# Altium project Function_Generator.PrjPcb
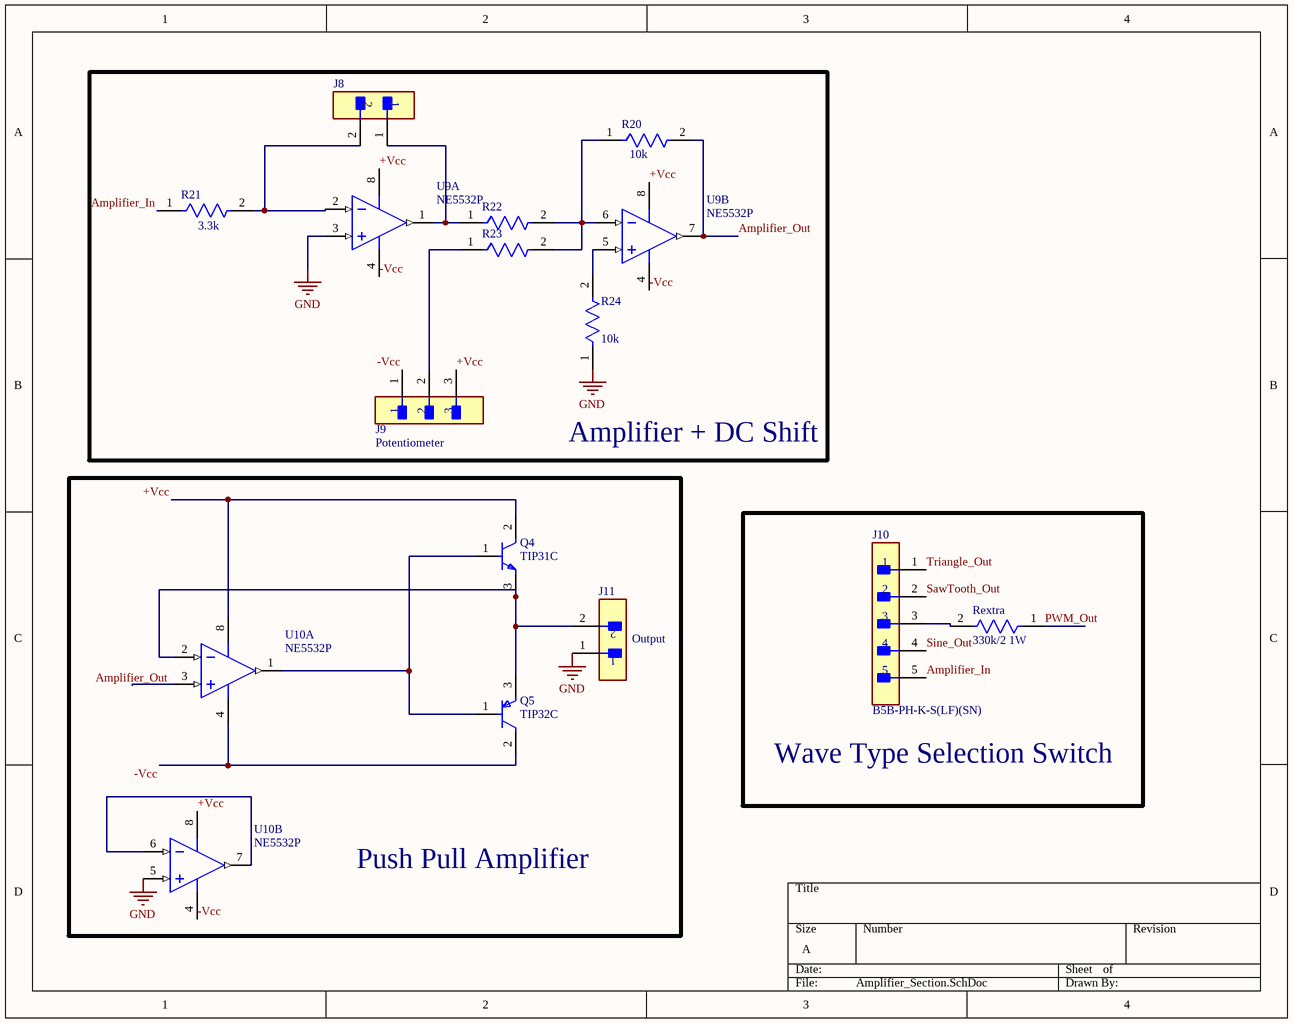
[diagram p0: Amplifier_Section.SchDoc]
6 sheets, 73 parts. Net scope: global (net labels, ports and power ports of the same name join across sheets).
Board file: The_PCB.PcbDoc
Sheets:
  Amplifier_Section.SchDoc
  Saw Tooth and PWM Generator.SchDoc
  Sine_Wave_Generator.SchDoc
  Buffers.SchDoc
  Triangle_Generator.SchDoc
  Power_Supply.SchDoc

## Sheet Amplifier_Section.SchDoc
size A; SheetNumber: 1; SheetTotal: 6

### Parts
J8  (no value)  [FP-B2B-XH-A_LF_SN-MFG]
J9  Potentiometer  [FP-440054-3-MFG]
J10  B5B-PH-K-S(LF)(SN)  [FP-B5B-PH-K-S_LF_SN-MFG]
J11  Output  [FP-B2B-XH-A_LF_SN-MFG]
Q4  TIP31C  [FP-TO-220-P0A0015988-MFG]
Q5  TIP32C  [FP-TO-220-P0A0015988-MFG]
R20  10k  [FP-VR37-MFG]
R21  3.3k  [FP-VR37-MFG]
R22  (no value)  [FP-VR37-MFG]
R23  (no value)  [FP-VR37-MFG]
R24  10k  [FP-VR37-MFG]
Rextra  330k/2 1W  [FP-RR01-MFG]
U9  NE5532P  [P0008A]  (parts A,B of 2)
U10  NE5532P  [P0008A]  (parts A,B of 2)

### Blocks framed on the sheet
Amplifier + DC Shift: J8 J9 R20-R24 U9
Push Pull Amplifier: J11 Q4 Q5 U10
Wave Type Selection Switch: J10 Rextra

### Nets
GND: J11.1 R24.1 U9.3(IN1+) U10.5(IN2+)
+Vcc: J9.3 Q4.2(C) U9.8(VCC+) U10.8(VCC+)
-Vcc: J9.1 Q5.2(C) U9.4(VCC-) U10.4(VCC-)
Amplifier_In: J10.5 R21.1
Amplifier_Out: R20.2 U9.7(OUT2) U10.3(IN1+)
PWM_Out: Rextra.1
SawTooth_Out: J10.2
Sine_Out: J10.4
Triangle_Out: J10.1
NetJ8_1: J8.1 R22.1 U9.1(OUT1)
NetJ8_2: J8.2 R21.2 U9.2(IN1-)
NetJ9_2: J9.2 R23.1
NetJ10_3: J10.3 Rextra.2
NetJ11_2: J11.2 Q4.3(E) Q5.3(E) U10.2(IN1-)
NetQ4_1: Q4.1(B) Q5.1(B) U10.1(OUT1)
NetR20_1: R20.1 R22.2 R23.2 U9.6(IN2-)
NetR24_2: R24.2 U9.5(IN2+)
NetU10_6: U10.6(IN2-) U10.7(OUT2)

### Library data of the parts
J8 J11 = CMP-2000-05888-3: CONN HEADER VERT 2POS 2.5MM; Current Rating: 3A; Voltage Rating: 250V; Number of Contacts: 2; Contact Resistance: 20mR; Wire/Cable Gauge: 22AWG; Insulation Resistance: 1GR; Connector Type: Male Pin; Packaging: Bulk; Contact Material: Brass; Lead Free: Lead Free; Orientation: Straight; Contact Plating: Tin; Max Current Rating: 3A; Termination: Solder; Fastening Type: Detent; Depth: 5.75mm; Housing Material: Polyamide; REACH SVHC: No SVHC; Series: XH; Voltage Rating (AC): 250V; Number of Positions: 2; Color: Natural; Contact Type: Male Pin; Max Voltage Rating (DC): 250V; Pitch: 2.5mm; Lead Pitch: 2.5mm; Mount: Through Hole; Max Operating Temperature: 85°C; Length: 7.4mm; Max Voltage Rating (AC): 250V; Min Operating Temperature: -25°C; Number of Rows: 1; Housing Color: White
J9 = CMP-03369-000008-1: CONN HEADER VERT 3POS 2MM; Manufacturer: TE Connectivity; Manufacturer Part Number: 440054-3; Voltage Rating: 250V; Number Of Contacts: 3; Conn Gender: Male; Conn Orientation: Vertical; Current Rating: 3A; Octopart: https://octopart.com/440054-3-te+connectivity-40394845; Device Class L3: unset; Device Class L1: Connectors; Number Of Rows: 1; Temperature: -25°C to +105°C; Temperature Range Low: -25°C; Automotive: No; Package: 0; ComponentLink2URL: https://www.te.com/usa-en/product-440054-3.datasheet.pdf; Device Class L2: Headers and Wire Housings; Temperature Range High: +105°C; Digikey Description: CONN HEADER VERT 3POS 2MM; Contact Material: Tin,Nickel; Footprint Url: https://www.te.com/commerce/DocumentDelivery/DDEController?Action=showdoc&DocId=Customer+Drawing%7F440054%7FF6%7Fpdf%7FEnglish%7FENG_CD_440054_F6.pdf%7F440054-3; RoHS: TRUE; ComponentLink2Description: Datasheet; Mouser Description: Headers & Wire Housings 3 POS HDR VERT 2.0mm; Lead Free: Yes; Category: Conn; Height: 6.35mm; Pitch: 2mm
J10 = CMP-2000-05908-2: CONN HEADER VERT 5POS 2MM; Voltage Rating (AC): 100V; Number of Positions: 5; Contact Resistance: 20mR; Insulation Resistance: 1MR; Current Rating: 2A; Gender: Male; Mated Stacking Heights: 8mm; Series: PH; Number of Poles: 5; Width: 4.5mm; Insulation Color: Natural; Fastening Type: Detent; Flammability Rating: UL94 V-0; Mount: Through Hole; Lead Free: Lead Free; Number of Rows: 1; REACH SVHC: No SVHC; Max Voltage Rating (AC): 100V; Contact Mating Length: 0.13inch; Contact Plating: Tin; Housing Material: Polyamide; Depth: 4.5mm; Contact Type: Male Pin; Voltage Rating: 100V; Color: Natural; Housing Color: White; Lead Pitch: 2mm; Number of Contacts: 5; Orientation: Straight; Packaging: Bulk; Contact Material: Brass; Pitch: 2mm; Insulation Material: Nylon; Connector Type: Header; Contact Finish - Mating: TIN; Termination: Solder; Number of Pins: 5; Length: 11.9mm; Contact Shape: Square; Max Current Rating: 2A; Working Voltage: 100V; Min Operating Temperature: -25°C; Max Operating Temperature: 85°C; Material: Polyamide; Height: 9.4mm
Q4 = CMP-12195-000001-1: TRANS NPN 100V 3A TO-220; Manufacturer: STMicroelectronics; Hfe Max: 50; Number Of Npn: 1; Max Junction Temp: +150°C; Standoff Height: 3.5mm; Emitter Base Voltage: 5V; Collector Emitter Saturation Voltage: 1.2V; Power Dissipation: 2W; Hfe Testvce: 4V; Hfe Min: 10; Device Class L2: Transistors; ComponentLink2URL: https://www.st.com/resource/en/datasheet/tip31c.pdf; Device Class L1: Discrete Semiconductors; Digikey Description: TRANS NPN 100V 3A TO-220; Max Collector Current: 3A; RoHS: TRUE; Height: 19.68mm; Mouser Description: Bipolar Transistors - BJT NPN Gen Pur Power; Number Of Elements: 1; Package: TO-220-P0A0015988; Temperature: to +150°C; Octopart: https://octopart.com/tip31c-stmicroelectronics-15555; Manufacturer Part Number: TIP31C; Category: Trans; Hfe Testic: 3A; Lead Free: Yes; Collector Base Voltage: 100V; Device Class L3: BJTs; Collector Emitter Voltage: 100V; Automotive: No; ComponentLink2Description: Datasheet; Temperature Range High: +150°C
Q5 = CMP-12195-000005-1: TRANS PNP 100V 3A TO-220; Manufacturer: STMicroelectronics; Standoff Height: 3.5mm; Number Of Pnp: 1; Max Collector Current: -3A; Emitter Base Voltage: -5V; Collector Emitter Voltage: -100V; Hfe Testvce: -4V; Hfe Max: 50; Collector Emitter Saturation Voltage: -1.2V; Power Dissipation: 2W; Max Junction Temp: +150°C; Hfe Min: 10; Device Class L3: BJTs; Mouser Description: Original ST Microelectronics Transistor, 100V, 3A, .22 Ohm, TO-220 Package; ComponentLink2Description: Datasheet; Device Class L1: Discrete Semiconductors; Automotive: No; Number Of Elements: 1; Category: Trans; Collector Base Voltage: -100V; Package: TO-220-P0A0015988; Height: 19.68mm; Lead Free: Yes; ComponentLink2URL: https://www.st.com/resource/en/datasheet/tip32c.pdf; Hfe Testic: -3A; RoHS: TRUE; Temperature Range High: +150°C; Temperature: to +150°C; Device Class L2: Transistors; Digikey Description: TRANS PNP 100V 3A TO-220; Octopart: https://octopart.com/tip32c-stmicroelectronics-353617; Manufacturer Part Number: TIP32C
R20-R24 = CMP-02408-000054-1: RES 1.2M OHM 5% 1/2W AXIAL; Voltage Rating: 3.5kV; Power Rating: 500mW; Temperature Coefficient: 200ppm/°C; Resistance: 1.2MR; Diameter: 4mm; Max Operating Temperature: 155°C; Military Standard: Not; Reach SVHC Compliant: Yes; Min Operating Temperature: -55°C; Resistance Tolerance: 5%; Resistor Type: Metal Film; Tolerance: 5%; Mount: Through Hole; Construction: Cylindrical; Contact Plating: Tin; Length: 10mm; Termination: Axial; Voltage Rating (DC): 3.5kV; Packaging: Ammo Pack; Radiation Hardening: No; Case/Package: Conformal
Rextra = CMP-03212-000008-1: RES 100K OHM 5% 1W AXIAL; Number of Resistors: 1; Temperature Coefficient: 300ppm/°C; Voltage Rating: 350V; Resistance: 100kR; Package Quantity: 5000; Power Rating: 1W; Packaging: Ammo Pack; Min Operating Temperature: -55°C; Number of Terminations: 2; Resistor Type: Power resistor; Length: 6.8mm; ELV: Compliant; Mount: Axial; RoHS Compliant: Yes; Case/Package: Metal; Diameter: 2.6mm; Termination: Axial; Series: RR; Max Operating Temperature: 155°C; Tolerance: 5%
U9 U10 = CMP-0017-00910-2: Dual Low-Noise High-Speed Audio Operational Amplifier, 10 to 30 V, 0 to 70 degC, 8-pin DIP (P8), Pb-Free (RoHS); Manufacturer: Texas Instruments; Iq per channel(Max)(mA): 4; Slew Rate(Typ)(V/us): 9; Vn at 1kHz(Typ)(nV/rtHz): 5; IIB(Max)(pA): 800000; Total Supply Voltage(Max)(+5V is 5, +/-5V is 10): 30; GBW(Typ)(MHz): 10; CMRR(Min)(dB): 70; Number of Channels: 2; Sub Family: General Purpose Amplifier, High Supply Voltage Amplifier (>=30V), Low Noise Amp (<=10nV/rtHz); ComponentLink2URL: http://www.ti.com/lit/ds/symlink/ne5532.pdf; PackageReference: P0008A; PackageDescription: 8-Pin Plastic In-Line, Body 9.59 x 6.35 mm, Pitch 2.54 mm; ComponentLink1Description: Manufacturer URL; Eco-Plan: Pb-Free (RoHS); Mounting Technology: Through Hole; Code_JEDEC: MS-001; PackageVersion: 4040082/E, 04/2010; DatasheetVersion: SLOS075I; ComponentLink3URL: http://www.ti.com/litv/pdf/mpdi001b; ComponentLink2Description: Datasheet; Vio (25C)(Max)(mV): 4; PartNumber: NE5532P; ComponentLink3Description: Package Specification; Total Supply Voltage(Min)(+5V is 5, +/-5V is 10): 10; ComponentLink1URL: http://www.ti.com/

## Sheet Saw Tooth and PWM Generator.SchDoc
size A; SheetNumber: 2; SheetTotal: 6
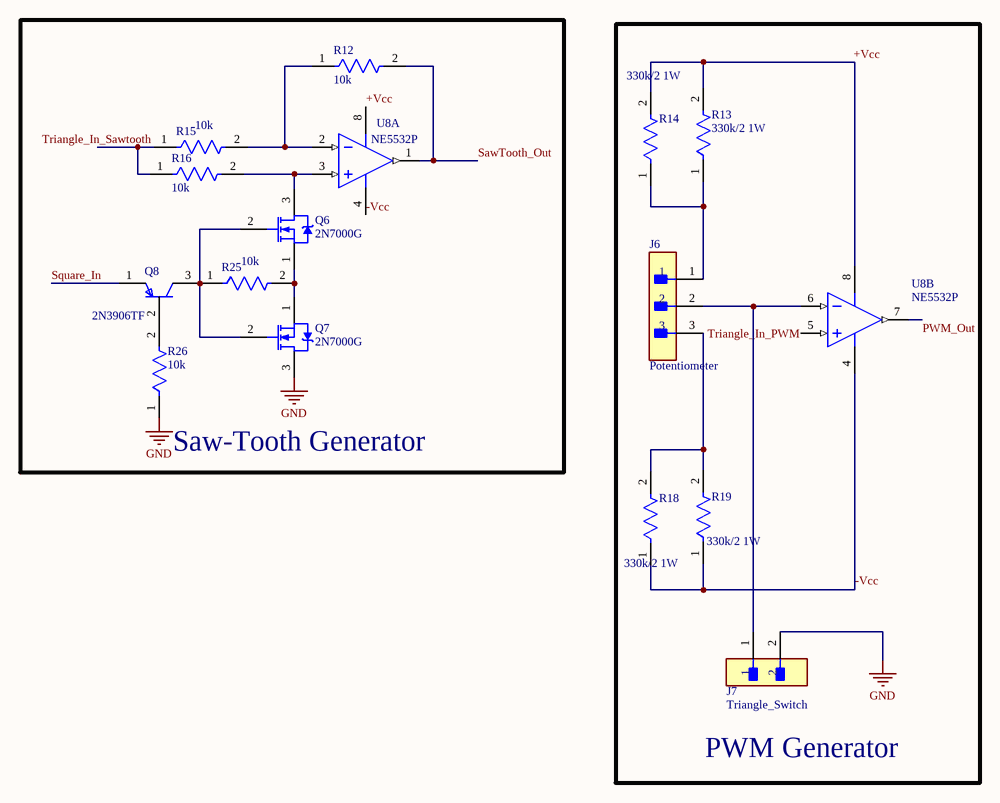
[diagram p1: Saw Tooth and PWM Generator.SchDoc]

### Parts
J6  Potentiometer  [FP-440054-3-MFG]
J7  Triangle_Switch  [FP-B2B-XH-A_LF_SN-MFG]
Q6  2N7000G  [ONSC-TO-92-3-29-11]
Q7  2N7000G  [ONSC-TO-92-3-29-11]
Q8  2N3906TF  [FP-135AR-MFG]
R12  10k  [FP-VR37-MFG]
R13  330k/2 1W  [FP-RR01-MFG]
R14  330k/2 1W  [FP-RR01-MFG]
R15  10k  [FP-VR37-MFG]
R16  10k  [FP-VR37-MFG]
R18  330k/2 1W  [FP-RR01-MFG]
R19  330k/2 1W  [FP-RR01-MFG]
R25  10k  [FP-VR37-MFG]
R26  10k  [FP-VR37-MFG]
U8  NE5532P  [P0008A]  (parts A,B of 2)

### Blocks framed on the sheet
Saw-Tooth Generator: Q6-Q8 R12 R15 R16 R25 R26 U8
PWM Generator: J6 J7 R13 R14 R18 R19 U8

### Nets
GND: J7.2 Q7.3(D) R26.1
+Vcc: R13.2 R14.2 U8.8(VCC+)
-Vcc: R18.1 R19.1 U8.4(VCC-)
PWM_Out: U8.7(OUT2)
SawTooth_Out: R12.2 U8.1(OUT1)
Square_In: Q8.1(E)
Triangle_In_PWM: U8.5(IN2+)
Triangle_In_Sawtooth: R15.1 R16.1
NetJ6_1: J6.1 R13.1 R14.1
NetJ6_2: J6.2 J7.1 U8.6(IN2-)
NetJ6_3: J6.3 R18.2 R19.2
NetQ6_1: Q6.1(S) Q7.1(S) R25.2
NetQ6_2: Q6.2(G) Q7.2(G) Q8.3(C) R25.1
NetQ6_3: Q6.3(D) R16.2 U8.3(IN1+)
NetQ8_2: Q8.2(B) R26.2
NetR12_1: R12.1 R15.2 U8.2(IN1-)

### Library data of the parts
J6 = CMP-03369-000008-1: as J9 on sheet Amplifier_Section; Octopart: https://octopart.com/440054-3-te+connectivity-40394845; Device Class L3: unset; Device Class L1: Connectors; Number Of Rows: 1; Temperature: -25°C to +105°C; Temperature Range Low: -25°C; Automotive: No; Package: 0; ComponentLink2URL: https://www.te.com/usa-en/product-440054-3.datasheet.pdf; Device Class L2: Headers and Wire Housings; Temperature Range High: +105°C; Digikey Description: CONN HEADER VERT 3POS 2MM; Contact Material: Tin,Nickel; Footprint Url: https://www.te.com/commerce/DocumentDelivery/DDEController?Action=showdoc&DocId=Customer+Drawing%7F440054%7FF6%7Fpdf%7FEnglish%7FENG_CD_440054_F6.pdf%7F440054-3; RoHS: TRUE; ComponentLink2Description: Datasheet; Mouser Description: Headers & Wire Housings 3 POS HDR VERT 2.0mm; Lead Free: Yes; Category: Conn; Height: 6.35mm; Pitch: 2mm
J7 = CMP-2000-05888-3: as J8 on sheet Amplifier_Section; Packaging: Bulk; Contact Material: Brass; Lead Free: Lead Free; Orientation: Straight; Contact Plating: Tin; Max Current Rating: 3A; Termination: Solder; Fastening Type: Detent; Depth: 5.75mm; Housing Material: Polyamide; REACH SVHC: No SVHC; Series: XH; Voltage Rating (AC): 250V; Number of Positions: 2; Color: Natural; Contact Type: Male Pin; Max Voltage Rating (DC): 250V; Pitch: 2.5mm; Lead Pitch: 2.5mm; Mount: Through Hole; Max Operating Temperature: 85°C; Length: 7.4mm; Max Voltage Rating (AC): 250V; Min Operating Temperature: -25°C; Number of Rows: 1; Housing Color: White
Q6 Q7 = CMP-1058-00937-1: Small Signal MOSFET, 200 mA, 60 V, N-Channel, 3-Pin TO-92, Pb-Free, Bulk Box; Manufacturer: On Semiconductor; Coss Typ (pF): 25; ID Max (A): 0.2; Ciss Typ (pF): 60; VGS(th) Max (V): 3; PD Max (W): 0.35; Configuration: Single; Channel Polarity: N Channel; VGS Max (V): 20; Crss Typ (pF): 5; RoHS: Pb-Free; PackageVersion: Rev. AM; Mounting Technology: Through Hole; PackageReference: TO-92-3-29-11_AM_SL; ComponentLink1Description: Manufacturer URL; PartNumber: 2N7000G; Package Type: TO-92; ComponentLink3Description: Package Specification; ComponentLink2Description: Datasheet; ComponentLink3URL: http://www.onsemi.cn/pub_link/Collateral/2N6426-D.PDF; DatasheetVersion: Rev. 8; Packing: Bulk Box; PackageDescription: 3-Pin Transistor Outline, Body 4.825 x 3.685 mm, Pitch 1.27 mm; ComponentLink1URL: http://www.onsemi.com/; V(BR)DSS Min (V): 60; ComponentLink2URL: http://www.onsemi.com/pub_link/Collateral/2N7000-D.PDF
Q8 = CMP-00278-84408866-1: 2N3906TF Small Signal Bipolar Transistor, 0.2A I(C), 40V V(BR)CEO, 1-Element, PNP, Silicon, TO-92; Manufacturer Lifecycle Status: ACTIVE; Collector Base Voltage (VCBO): -40V; Frequency: 250MHz; Number of Elements: 1; Max Power Dissipation: 625mW; Max Breakdown Voltage: 160V; Current Rating: -200mA; Emitter Base Voltage (VEBO): -5V; Collector Emitter Saturation Voltage: -400mV; Element Configuration: Single; Max Junction Temperature (Tj): 150°C; hFE Min: 100; Polarity: PNP; Lead Free: Lead Free; RoHS: Compliant; Max Operating Temperature: 150°C; Collector Emitter Voltage (VCEO): -40V; Max Frequency: 250MHz; Power Dissipation: 625mW; Height: 5.33mm; Schedule B: 8541210080; Mount: Through Hole; Length: 5.2mm; REACH SVHC: No SVHC; Min Operating Temperature: -55°C; Gain Bandwidth Product: 250MHz; Number of Pins: 3; Lifecycle Status: Production; Transition Frequency: 250MHz; NexarPartId: 84408866; Collector Emitter Breakdown Voltage: -40V; Case/Package: TO-92; Packaging: Tape and Reel; Width: 4.19mm; Max Collector Current: -200mA; Radiation Hardening: No; Weight: 240mg; Voltage Rating (DC): -40V
R12 R15 R16 R25 R26 = CMP-02408-000054-1: as R20 on sheet Amplifier_Section; Diameter: 4mm; Max Operating Temperature: 155°C; Military Standard: Not; Reach SVHC Compliant: Yes; Min Operating Temperature: -55°C; Resistance Tolerance: 5%; Resistor Type: Metal Film; Tolerance: 5%; Mount: Through Hole; Construction: Cylindrical; Contact Plating: Tin; Length: 10mm; Termination: Axial; Voltage Rating (DC): 3.5kV; Packaging: Ammo Pack; Radiation Hardening: No; Case/Package: Conformal
R13 R14 R18 R19 = CMP-03212-000008-1: as Rextra on sheet Amplifier_Section; Package Quantity: 5000; Power Rating: 1W; Packaging: Ammo Pack; Min Operating Temperature: -55°C; Number of Terminations: 2; Resistor Type: Power resistor; Length: 6.8mm; ELV: Compliant; Mount: Axial; RoHS Compliant: Yes; Case/Package: Metal; Diameter: 2.6mm; Termination: Axial; Series: RR; Max Operating Temperature: 155°C; Tolerance: 5%
U8 = CMP-0017-00910-2: as U9 on sheet Amplifier_Section; ComponentLink2URL: http://www.ti.com/lit/ds/symlink/ne5532.pdf; PackageReference: P0008A; PackageDescription: 8-Pin Plastic In-Line, Body 9.59 x 6.35 mm, Pitch 2.54 mm; ComponentLink1Description: Manufacturer URL; Eco-Plan: Pb-Free (RoHS); Mounting Technology: Through Hole; Code_JEDEC: MS-001; PackageVersion: 4040082/E, 04/2010; DatasheetVersion: SLOS075I; ComponentLink3URL: http://www.ti.com/litv/pdf/mpdi001b; ComponentLink2Description: Datasheet; Vio (25C)(Max)(mV): 4; PartNumber: NE5532P; ComponentLink3Description: Package Specification; Total Supply Voltage(Min)(+5V is 5, +/-5V is 10): 10; ComponentLink1URL: http://www.ti.com/

## Sheet Sine_Wave_Generator.SchDoc
size A; SheetNumber: 4; SheetTotal: 4
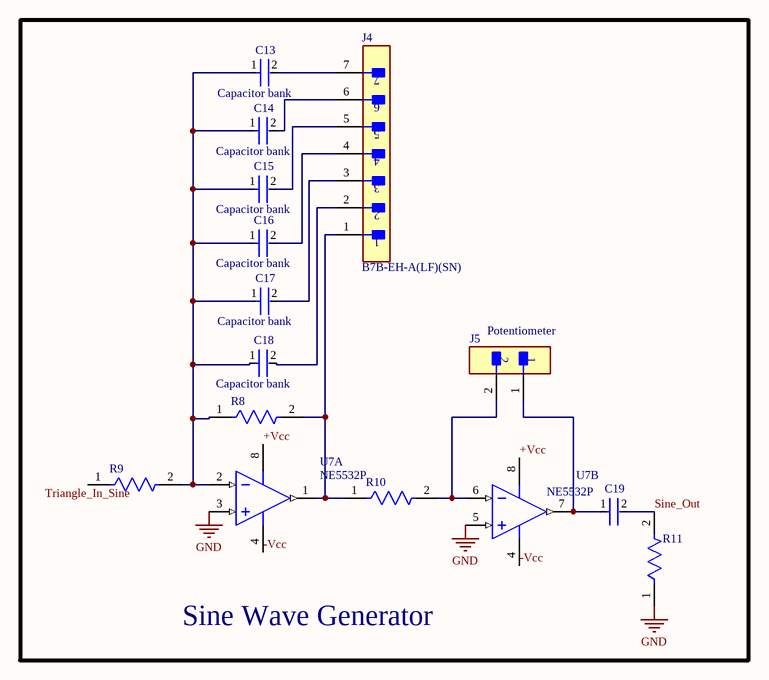
[diagram p2: Sine_Wave_Generator.SchDoc]

### Parts
C13  Capacitor bank  [FP-F471K33Y5RP6UK5R-MFG]
C14  Capacitor bank  [FP-F471K33Y5RP6UK5R-MFG]
C15  Capacitor bank  [FP-F471K33Y5RP6UK5R-MFG]
C16  Capacitor bank  [FP-F471K33Y5RP6UK5R-MFG]
C17  Capacitor bank  [FP-F471K33Y5RP6UK5R-MFG]
C18  Capacitor bank  [FP-F471K33Y5RP6UK5R-MFG]
C19  (no value)  [FP-F471K33Y5RP6UK5R-MFG]
J4  B7B-EH-A(LF)(SN)  [FP-B7B-EH-A_LF_SN-MFG]
J5  Potentiometer  [FP-B2B-XH-A_LF_SN-MFG]
R8  (no value)  [FP-VR37-MFG]
R9  (no value)  [FP-VR37-MFG]
R10  (no value)  [FP-VR37-MFG]
R11  (no value)  [FP-VR37-MFG]
U7  NE5532P  [P0008A]  (parts A,B of 2)

### Blocks framed on the sheet
Sine Wave Generator: C13-C19 J4 J5 R8-R11 U7

### Nets
GND: R11.1 U7.3(IN1+) U7.5(IN2+)
+Vcc: U7.8(VCC+)
-Vcc: U7.4(VCC-)
Sine_Out: C19.2 R11.2
Triangle_In_Sine: R9.1
NetC13_1: C13.1 C14.1 C15.1 C16.1 C17.1 C18.1 R8.1 R9.2 U7.2(IN1-)
NetC13_2: C13.2 J4.7
NetC14_2: C14.2 J4.6
NetC15_2: C15.2 J4.5
NetC16_2: C16.2 J4.4
NetC17_2: C17.2 J4.3
NetC18_2: C18.2 J4.2
NetC19_1: C19.1 J5.1 U7.7(OUT2)
NetJ4_1: J4.1 R8.2 R10.1 U7.1(OUT1)
NetJ5_2: J5.2 R10.2 U7.6(IN2-)

### Library data of the parts
C13-C19 = CMP-02417-000080-1: CAP CER 470PF 2KV Y5R RADIAL; Tolerance: 10%; Dielectric Material: Ceramic; Insulation Resistance: 10GR; Lead/Base Style: Kinked; Lead Diameter: 0.8mm; Series: F; Depth: 5mm; Package Quantity: 1500; Resistor Type: Ceramic; Construction: RADIAL; Min Operating Temperature: -30°C; Mount: Through Hole; Radiation Hardening: No; Voltage: 2kV; Voltage Rating: 2kV; Max Operating Temperature: 125°C; Termination: Radial; RoHS Compliant: Yes; Lead Pitch: 5mm; Capacitance: 470pF; Packaging: Tape and Reel; Length: 8.5mm; Case/Package: Radial; Dielectric: Y5R
J4 = CMP-17439-000532-1: CONN HEADER VERT 7POS 2.5MM; Number of Contacts: 7; Mated Stacking Heights: 8.1mm; Gender: Male; Current Rating: 3A; Voltage Rating: 250V; Termination: Solder; Contact Material: Brass; Connector Type: Header; Flammability Rating: UL94 V-0; Housing Material: Nylon; Series: EH; Fastening Type: Friction; Lead Free: Lead Free; Insulation Color: Natural; Contact Type: Male Pin; Number of Rows: 1; Packaging: Bulk; Color: Natural; Contact Finish - Mating: TIN; Orientation: Straight; Contact Shape: Square; Contact Plating: Tin; Insulation Material: Nylon; Housing Color: White; Mount: Through Hole; Contact Mating Length: 0.13inch; Pitch: 2.5mm; Number of Positions: 7
J5 = CMP-2000-05888-3: as J8 on sheet Amplifier_Section; Packaging: Bulk; Contact Material: Brass; Lead Free: Lead Free; Orientation: Straight; Contact Plating: Tin; Max Current Rating: 3A; Termination: Solder; Fastening Type: Detent; Depth: 5.75mm; Housing Material: Polyamide; REACH SVHC: No SVHC; Series: XH; Voltage Rating (AC): 250V; Number of Positions: 2; Color: Natural; Contact Type: Male Pin; Max Voltage Rating (DC): 250V; Pitch: 2.5mm; Lead Pitch: 2.5mm; Mount: Through Hole; Max Operating Temperature: 85°C; Length: 7.4mm; Max Voltage Rating (AC): 250V; Min Operating Temperature: -25°C; Number of Rows: 1; Housing Color: White
R8-R11 = CMP-02408-000054-1: as R20 on sheet Amplifier_Section; Diameter: 4mm; Max Operating Temperature: 155°C; Military Standard: Not; Reach SVHC Compliant: Yes; Min Operating Temperature: -55°C; Resistance Tolerance: 5%; Resistor Type: Metal Film; Tolerance: 5%; Mount: Through Hole; Construction: Cylindrical; Contact Plating: Tin; Length: 10mm; Termination: Axial; Voltage Rating (DC): 3.5kV; Packaging: Ammo Pack; Radiation Hardening: No; Case/Package: Conformal
U7 = CMP-0017-00910-2: as U9 on sheet Amplifier_Section; ComponentLink2URL: http://www.ti.com/lit/ds/symlink/ne5532.pdf; PackageReference: P0008A; PackageDescription: 8-Pin Plastic In-Line, Body 9.59 x 6.35 mm, Pitch 2.54 mm; ComponentLink1Description: Manufacturer URL; Eco-Plan: Pb-Free (RoHS); Mounting Technology: Through Hole; Code_JEDEC: MS-001; PackageVersion: 4040082/E, 04/2010; DatasheetVersion: SLOS075I; ComponentLink3URL: http://www.ti.com/litv/pdf/mpdi001b; ComponentLink2Description: Datasheet; Vio (25C)(Max)(mV): 4; PartNumber: NE5532P; ComponentLink3Description: Package Specification; Total Supply Voltage(Min)(+5V is 5, +/-5V is 10): 10; ComponentLink1URL: http://www.ti.com/

## Sheet Buffers.SchDoc
size A; SheetNumber: 3; SheetTotal: 3
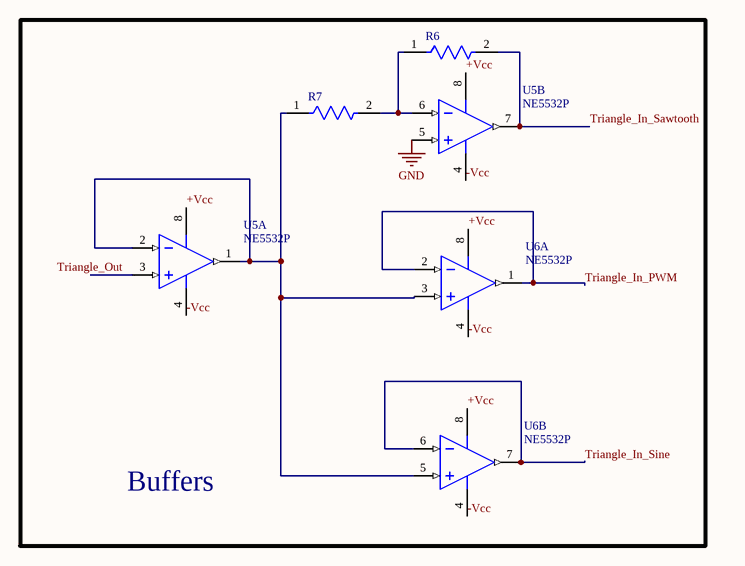
[diagram p3: Buffers.SchDoc]

### Parts
R6  (no value)  [FP-VR37-MFG]
R7  (no value)  [FP-VR37-MFG]
U5  NE5532P  [P0008A]  (parts A,B of 2)
U6  NE5532P  [P0008A]  (parts A,B of 2)

### Blocks framed on the sheet
Buffers: R6 R7 U5 U6

### Nets
GND: U5.5(IN2+)
+Vcc: U5.8(VCC+) U6.8(VCC+)
-Vcc: U5.4(VCC-) U6.4(VCC-)
Triangle_In_PWM: U6.1(OUT1) U6.2(IN1-)
Triangle_In_Sawtooth: R6.2 U5.7(OUT2)
Triangle_In_Sine: U6.6(IN2-) U6.7(OUT2)
Triangle_Out: U5.3(IN1+)
NetR6_1: R6.1 R7.2 U5.6(IN2-)
NetR7_1: R7.1 U5.1(OUT1) U5.2(IN1-) U6.3(IN1+) U6.5(IN2+)

### Library data of the parts
R6 R7 = CMP-02408-000054-1: as R20 on sheet Amplifier_Section; Diameter: 4mm; Max Operating Temperature: 155°C; Military Standard: Not; Reach SVHC Compliant: Yes; Min Operating Temperature: -55°C; Resistance Tolerance: 5%; Resistor Type: Metal Film; Tolerance: 5%; Mount: Through Hole; Construction: Cylindrical; Contact Plating: Tin; Length: 10mm; Termination: Axial; Voltage Rating (DC): 3.5kV; Packaging: Ammo Pack; Radiation Hardening: No; Case/Package: Conformal
U5 U6 = CMP-0017-00910-2: as U9 on sheet Amplifier_Section; ComponentLink2URL: http://www.ti.com/lit/ds/symlink/ne5532.pdf; PackageReference: P0008A; PackageDescription: 8-Pin Plastic In-Line, Body 9.59 x 6.35 mm, Pitch 2.54 mm; ComponentLink1Description: Manufacturer URL; Eco-Plan: Pb-Free (RoHS); Mounting Technology: Through Hole; Code_JEDEC: MS-001; PackageVersion: 4040082/E, 04/2010; DatasheetVersion: SLOS075I; ComponentLink3URL: http://www.ti.com/litv/pdf/mpdi001b; ComponentLink2Description: Datasheet; Vio (25C)(Max)(mV): 4; PartNumber: NE5532P; ComponentLink3Description: Package Specification; Total Supply Voltage(Min)(+5V is 5, +/-5V is 10): 10; ComponentLink1URL: http://www.ti.com/

## Sheet Triangle_Generator.SchDoc
size A; SheetNumber: 2; SheetTotal: 2
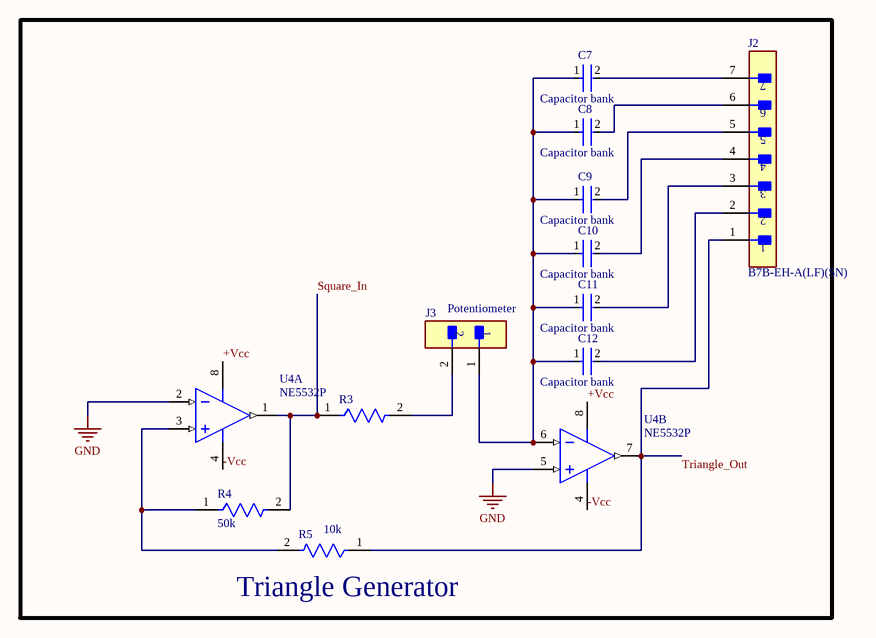
[diagram p4: Triangle_Generator.SchDoc]

### Parts
C7  Capacitor bank  [FP-F471K33Y5RP6UK5R-MFG]
C8  Capacitor bank  [FP-F471K33Y5RP6UK5R-MFG]
C9  Capacitor bank  [FP-F471K33Y5RP6UK5R-MFG]
C10  Capacitor bank  [FP-F471K33Y5RP6UK5R-MFG]
C11  Capacitor bank  [FP-F471K33Y5RP6UK5R-MFG]
C12  Capacitor bank  [FP-F471K33Y5RP6UK5R-MFG]
J2  B7B-EH-A(LF)(SN)  [FP-B7B-EH-A_LF_SN-MFG]
J3  Potentiometer  [FP-B2B-XH-A_LF_SN-MFG]
R3  (no value)  [FP-VR37-MFG]
R4  50k  [FP-VR37-MFG]
R5  10k  [FP-VR37-MFG]
U4  NE5532P  [P0008A]  (parts A,B of 2)

### Blocks framed on the sheet
Triangle Generator: C7-C12 J2 J3 R3-R5 U4

### Nets
GND: U4.2(IN1-) U4.5(IN2+)
+Vcc: U4.8(VCC+)
-Vcc: U4.4(VCC-)
Square_In: R3.1 R4.2 U4.1(OUT1)
Triangle_Out: J2.1 R5.1 U4.7(OUT2)
NetC7_1: C7.1 C8.1 C9.1 C10.1 C11.1 C12.1 J3.1 U4.6(IN2-)
NetC7_2: C7.2 J2.7
NetC8_2: C8.2 J2.6
NetC9_2: C9.2 J2.5
NetC10_2: C10.2 J2.4
NetC11_2: C11.2 J2.3
NetC12_2: C12.2 J2.2
NetJ3_2: J3.2 R3.2
NetR4_1: R4.1 R5.2 U4.3(IN1+)

### Library data of the parts
C7-C12 = CMP-02417-000080-1: as C13 on sheet Sine_Wave_Generator; Series: F; Depth: 5mm; Package Quantity: 1500; Resistor Type: Ceramic; Construction: RADIAL; Min Operating Temperature: -30°C; Mount: Through Hole; Radiation Hardening: No; Voltage: 2kV; Voltage Rating: 2kV; Max Operating Temperature: 125°C; Termination: Radial; RoHS Compliant: Yes; Lead Pitch: 5mm; Capacitance: 470pF; Packaging: Tape and Reel; Length: 8.5mm; Case/Package: Radial; Dielectric: Y5R
J2 = CMP-17439-000532-1: as J4 on sheet Sine_Wave_Generator; Termination: Solder; Contact Material: Brass; Connector Type: Header; Flammability Rating: UL94 V-0; Housing Material: Nylon; Series: EH; Fastening Type: Friction; Lead Free: Lead Free; Insulation Color: Natural; Contact Type: Male Pin; Number of Rows: 1; Packaging: Bulk; Color: Natural; Contact Finish - Mating: TIN; Orientation: Straight; Contact Shape: Square; Contact Plating: Tin; Insulation Material: Nylon; Housing Color: White; Mount: Through Hole; Contact Mating Length: 0.13inch; Pitch: 2.5mm; Number of Positions: 7
J3 = CMP-2000-05888-3: as J8 on sheet Amplifier_Section; Packaging: Bulk; Contact Material: Brass; Lead Free: Lead Free; Orientation: Straight; Contact Plating: Tin; Max Current Rating: 3A; Termination: Solder; Fastening Type: Detent; Depth: 5.75mm; Housing Material: Polyamide; REACH SVHC: No SVHC; Series: XH; Voltage Rating (AC): 250V; Number of Positions: 2; Color: Natural; Contact Type: Male Pin; Max Voltage Rating (DC): 250V; Pitch: 2.5mm; Lead Pitch: 2.5mm; Mount: Through Hole; Max Operating Temperature: 85°C; Length: 7.4mm; Max Voltage Rating (AC): 250V; Min Operating Temperature: -25°C; Number of Rows: 1; Housing Color: White
R3-R5 = CMP-02408-000054-1: as R20 on sheet Amplifier_Section; Diameter: 4mm; Max Operating Temperature: 155°C; Military Standard: Not; Reach SVHC Compliant: Yes; Min Operating Temperature: -55°C; Resistance Tolerance: 5%; Resistor Type: Metal Film; Tolerance: 5%; Mount: Through Hole; Construction: Cylindrical; Contact Plating: Tin; Length: 10mm; Termination: Axial; Voltage Rating (DC): 3.5kV; Packaging: Ammo Pack; Radiation Hardening: No; Case/Package: Conformal
U4 = CMP-0017-00910-2: as U9 on sheet Amplifier_Section; ComponentLink2URL: http://www.ti.com/lit/ds/symlink/ne5532.pdf; PackageReference: P0008A; PackageDescription: 8-Pin Plastic In-Line, Body 9.59 x 6.35 mm, Pitch 2.54 mm; ComponentLink1Description: Manufacturer URL; Eco-Plan: Pb-Free (RoHS); Mounting Technology: Through Hole; Code_JEDEC: MS-001; PackageVersion: 4040082/E, 04/2010; DatasheetVersion: SLOS075I; ComponentLink3URL: http://www.ti.com/litv/pdf/mpdi001b; ComponentLink2Description: Datasheet; Vio (25C)(Max)(mV): 4; PartNumber: NE5532P; ComponentLink3Description: Package Specification; Total Supply Voltage(Min)(+5V is 5, +/-5V is 10): 10; ComponentLink1URL: http://www.ti.com/

## Sheet Power_Supply.SchDoc
size 431 x 279 mm; SheetNumber: 6; SheetTotal: 6
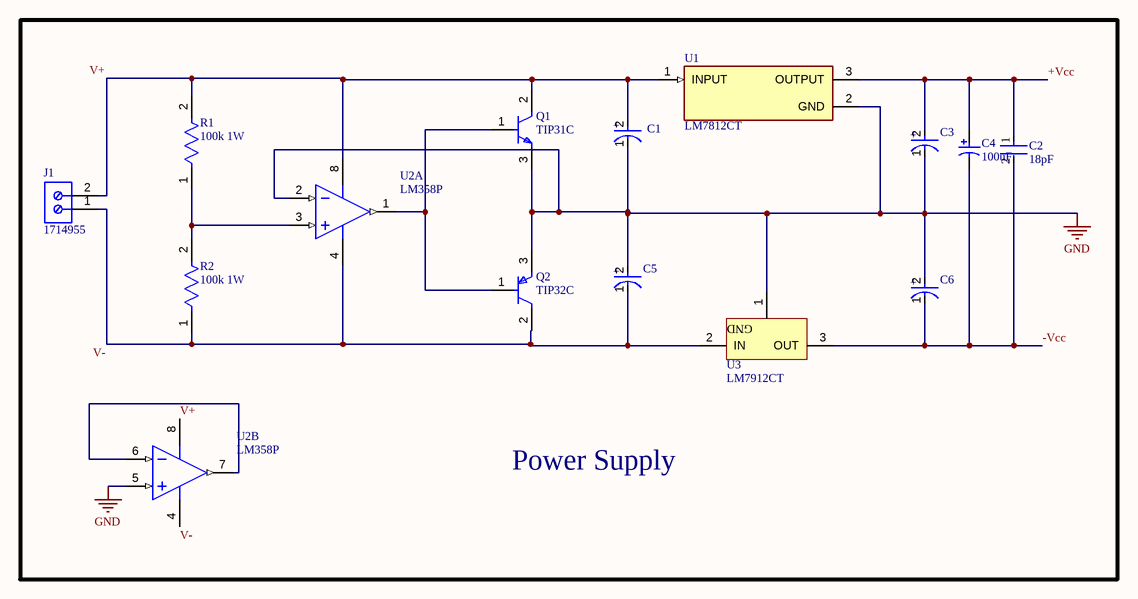
[diagram p5: Power_Supply.SchDoc]

### Parts
C1  EEUFC1H4R7B  [FP-RAD-TH-D_5_0_5-L_11_1-MFG]  (value not drawn)
C2  18pF  [FP-F471K33Y5RP6UK5R-MFG]
C3  EEUFC1H4R7B  [FP-RAD-TH-D_5_0_5-L_11_1-MFG]  (value not drawn)
C4  100uF  [CAPPR65-350-1150X800X1250]
C5  EEUFC1H4R7B  [FP-RAD-TH-D_5_0_5-L_11_1-MFG]  (value not drawn)
C6  EEUFC1H4R7B  [FP-RAD-TH-D_5_0_5-L_11_1-MFG]  (value not drawn)
J1  1714955  [PHOE-1714955_V]
Q1  TIP31C  [FP-TO-220-P0A0015988-MFG]
Q2  TIP32C  [FP-TO-220-P0A0015988-MFG]
R1  100k 1W  [FP-RR01-MFG]
R2  100k 1W  [FP-RR01-MFG]
U1  LM7812CT  [FP-TO220B03-MFG]
U2  LM358P  [P0008A]  (parts A,B of 2)
U3  LM7912CT  [NDE0003A]

### Blocks framed on the sheet
Power Supply: C1-C6 J1 Q1 Q2 R1 R2 U1-U3

### Nets
GND: C1.1(C) C3.1(C) C5.2(A) C6.2(A) Q1.3(E) Q2.3(E) U1.2(GND) U2.2(1IN-) U2.5(2IN+) U3.1(GND)
+Vcc: C2.1 C3.2(A) C4.1 U1.3(OUTPUT)
-Vcc: C2.2 C4.2 C6.1(C) U3.3(OUT)
V+: C1.2(A) J1.2 Q1.2(C) R1.2 U1.1(INPUT) U2.8(VCC)
V-: C5.1(C) J1.1 Q2.2(C) R2.1 U2.4(GND) U3.2(IN)
NetQ1_1: Q1.1(B) Q2.1(B) U2.1(1OUT)
NetR1_1: R1.1 R2.2 U2.3(1IN+)
NetU2_6: U2.6(2IN-) U2.7(2OUT)

### Notes on the sheet
- DWG. NO.
- REV.
- SHT.
- THIS DOCUMENT AND THE DATA DISCLOSED HEREIN OR HEREWITH IS THE PROPERTY OF ALTIUM LIMITED AND MAY BE FREELY DISTRIBUTED IN WHOLE. NO RIGHTS ARE RESERVED OR EXPRESS OR IMPLIED WARANTEE GIVEN.
- REVISION
- DESCRIPTION
- DATE
- APPROVED
- ENG:
- APPROVALS
- PROJECT
- DSN:
- CHK:
- REFERENCE DOCUMENTS
- PROJECT REVISION:
- TITLE
- DOCUMENT REVISION:
- DESIGN ITEM:
- BOM:
- FAB DWG:
- PCB DWG:
- ASSY DWG:
- SCALE:
- SIZE
- B
- CAGE CODE
- FILE NAME
- DWG NO.
- SHEET
- OF
- REV
- (in symbol CMP-05427-000609-1) +

### Library data of the parts
C1 C3 C5 C6 = CMP-05427-000609-1: Aluminum Electrolytic Capacitors (Radial Lead Type) AEC-Q200 Qualified 4.7uF ±20% 50V; Impedance: 1.3R; Life (Hours): 1000Hour; Polarity: Polar; Lead Diameter: 0.5mm; Ripple Current: 95mA; Ratings: AEC-Q200; Voltage Rating (DC): 50V; Voltage Rating: 50V; Lead Pitch: 5mm; Features: General Purpose; Height: 11mm; Radiation Hardening: No; Diameter: 5mm; Termination: Radial; Length: 11mm; Min Operating Temperature: -55°C; Height - Seated (Max): 0.472inch; Packaging: Tape and Reel; Max Operating Temperature: 105°C; ESR (Equivalent Series Resistance): 1.3R; RoHS Compliant: Yes; Package Quantity: 2000; Mount: Through Hole; Tolerance: 20%; Series: FC; Case/Package: Radial; Contact Plating: Tin
C2 = CMP-02417-000080-1: as C13 on sheet Sine_Wave_Generator; Series: F; Depth: 5mm; Package Quantity: 1500; Resistor Type: Ceramic; Construction: RADIAL; Min Operating Temperature: -30°C; Mount: Through Hole; Radiation Hardening: No; Voltage: 2kV; Voltage Rating: 2kV; Max Operating Temperature: 125°C; Termination: Radial; RoHS Compliant: Yes; Lead Pitch: 5mm; Capacitance: 470pF; Packaging: Tape and Reel; Length: 8.5mm; Case/Package: Radial; Dielectric: Y5R
C4 = CMP-1665-00042-2: Aluminum Electrolytic Capacitor, 100 uF, +/- 20%, 50 V, -40 to 85 degC, 2-Pin THD, RoHS, Bulk; Manufacturer: Panasonic; Lead Diameter: 0.6mm; Dielectric Material: Aluminium; Voltage Rating (DC): 50V; Ripple Current (AC): 250mA; Polarity: Polar; Leakage Current: 3uA; Life (Hours): 2000Hour; Lead/Base Style: Straight; Dissipation Factor: 0.12%; Radiation Hardening: No; Height: 11.5mm; Package Quantity: 200; Package Reference: CAPPR65-350-1150X800X1250; Min Operating Temperature: -40degC; Mount: ThroughHole; Package Description: 2-Pin Radial Lead, Dia 8 mm, Height 12.5 mm; Case/Package: Radial; Diameter: 8mm; Voltage Rating: 50V; Length: 11.5mm; REACH SVHC: NoSVHC; Height - Seated (Max): 0.492inch; Datasheet URL: https://industrial.panasonic.com/cdbs/www-data/pdf/RDF0000/ABA0000C1218.pdf; RoHSCompliant: true; Ripple Current: 250mA; Lead Free: LeadFree; Voltage: 50V; Manufacturer URL: http://www.panasonic.com/; Number of Pins: 2; Datasheet Version: Rev. 05, 10/2016; Packaging: Bulk; Termination: Radial; Max Operating Temperature: 85degC; Tolerance: 20%; Capacitance: 100uF; Lead Pitch: 3.5mm
J1 = CMP-2000-05797-1: PC Terminal Block, Pitch 6.35 mm, 1 x 2 Position, Height 21.5 mm, Tail Lenght 5.1 mm, RoHS, Bulk; Manufacturer: Phoenix Contact; Package Description: PC Terminal Block, Pitch 6.35 mm, 1 x 2 Position, Height 21.5 mm, Tail Lenght 5.1 mm; Datasheet URL: http://media.digikey.com/pdf/Data%20Sheets/Phoenix%20Contact%20PDFs/1714955.pdf; Package Reference: 1714955; Manufacturer URL: http://www.phoenixcontact.com/; Datasheet Version: 02/2010; Mounting Technology: ThroughHole
Q1 = CMP-12195-000001-1: as Q4 on sheet Amplifier_Section; Device Class L2: Transistors; ComponentLink2URL: https://www.st.com/resource/en/datasheet/tip31c.pdf; Device Class L1: Discrete Semiconductors; Digikey Description: TRANS NPN 100V 3A TO-220; Max Collector Current: 3A; RoHS: TRUE; Height: 19.68mm; Mouser Description: Bipolar Transistors - BJT NPN Gen Pur Power; Number Of Elements: 1; Package: TO-220-P0A0015988; Temperature: to +150°C; Octopart: https://octopart.com/tip31c-stmicroelectronics-15555; Manufacturer Part Number: TIP31C; Category: Trans; Hfe Testic: 3A; Lead Free: Yes; Collector Base Voltage: 100V; Device Class L3: BJTs; Collector Emitter Voltage: 100V; Automotive: No; ComponentLink2Description: Datasheet; Temperature Range High: +150°C
Q2 = CMP-12195-000005-1: as Q5 on sheet Amplifier_Section; Device Class L3: BJTs; Mouser Description: Original ST Microelectronics Transistor, 100V, 3A, .22 Ohm, TO-220 Package; ComponentLink2Description: Datasheet; Device Class L1: Discrete Semiconductors; Automotive: No; Number Of Elements: 1; Category: Trans; Collector Base Voltage: -100V; Package: TO-220-P0A0015988; Height: 19.68mm; Lead Free: Yes; ComponentLink2URL: https://www.st.com/resource/en/datasheet/tip32c.pdf; Hfe Testic: -3A; RoHS: TRUE; Temperature Range High: +150°C; Temperature: to +150°C; Device Class L2: Transistors; Digikey Description: TRANS PNP 100V 3A TO-220; Octopart: https://octopart.com/tip32c-stmicroelectronics-353617; Manufacturer Part Number: TIP32C
R1 R2 = CMP-03212-000008-1: as Rextra on sheet Amplifier_Section; Package Quantity: 5000; Power Rating: 1W; Packaging: Ammo Pack; Min Operating Temperature: -55°C; Number of Terminations: 2; Resistor Type: Power resistor; Length: 6.8mm; ELV: Compliant; Mount: Axial; RoHS Compliant: Yes; Case/Package: Metal; Diameter: 2.6mm; Termination: Axial; Series: RR; Max Operating Temperature: 155°C; Tolerance: 5%
U1 = CMP-07128-000015-1: IC REG LINEAR 12V 1A TO220-3; Obsolete Part: true; Manufacturer: ON Semiconductor; Nominal Supply Current: 5.1mA; Output Type: Fixed; Dropout Voltage: 2V; Max Supply Voltage: 35V; Accuracy Percentage: 4%; Standoff Height: 2.7mm; Number Of Outputs: 1; Octopart: https://octopart.com/lm7812ct-on+semiconductor-14383031; Output Current: 1A; ComponentLink2Description: Datasheet; Device Class L1: Integrated Circuits (ICs); Device Class L2: Power Management ICs; Temperature Range Low: -40°C; Category: IC; Package: TO220B03; Device Class L3: Voltage Regulators - Linear; RoHS: TRUE; Digikey Description: IC REG LINEAR 12V 1A TO220-3; Ipc Land Pattern Name: TO-220; Output Voltage: 12V; Temperature: -40°C to +125°C; Automotive: No; Temperature Range High: +125°C; ComponentLink2URL: https://www.mouser.in/datasheet/2/308/LM7812-1125088.pdf; Manufacturer Part Number: LM7812CT; Height: 20.4mm; Lead Free: Yes
U2 = CMP-2000-06549-1: Dual Operational Amplifier, 3 to 32 V, 0 to 70 degC, 8-Pin PDIP (P), RoHS, Tape and Reel; Manufacturer: Technik Industrial; Datasheet Version: Rev. T, 04/2015; Datasheet URL: http://www.ti.com/lit/ds/symlink/lm358.pdf; Manufacturer URL: http://www.technik.com.hk/; Package Description: 8-Pin Double In-line Package, Body 9.59 x 6.35 mm, Pitch 2.54 mm; Mounting Technology: ThroughHole; Package URL: http://www.ti.com/lit/ml/mpdi001b/mpdi001b.pdf; Package Reference: P8
U3 = CMP-0062-02472-3: 3-Terminal Negative Regulator, 3-pin TO-220; Manufacturer: Texas Instruments; CompType: LDO IC; PowerWise: N; PackageTopMarking: NSUZXYTTE#*LM7912CT; PinCount: 3; RoHS: N; PackageDescription: TO-220, Molded, 3 Lead, Straight; ComponentLink1URL: http://www.ti.com/general/docs/lit/getliterature.tsp?genericPartNumber=LM7912&fileType=pdf; PackageReference: NDE0003A; ComponentLink1Description: Datasheet URL

## Nets that join several sheets
GND: Amplifier_Section (J11.1 R24.1 U9.3 U10.5), Saw Tooth and PWM Generator (J7.2 Q7.3 R26.1), Sine_Wave_Generator (R11.1 U7.3 U7.5), Buffers (U5.5), Triangle_Generator (U4.2 U4.5), Power_Supply (10 pins)
+Vcc: Amplifier_Section (J9.3 Q4.2 U9.8 U10.8), Saw Tooth and PWM Generator (R13.2 R14.2 U8.8), Sine_Wave_Generator (U7.8), Buffers (U5.8 U6.8), Triangle_Generator (U4.8), Power_Supply (C2.1 C3.2 C4.1 U1.3)
-Vcc: Amplifier_Section (J9.1 Q5.2 U9.4 U10.4), Saw Tooth and PWM Generator (R18.1 R19.1 U8.4), Sine_Wave_Generator (U7.4), Buffers (U5.4 U6.4), Triangle_Generator (U4.4), Power_Supply (C2.2 C4.2 C6.1 U3.3)
PWM_Out: Amplifier_Section (Rextra.1), Saw Tooth and PWM Generator (U8.7)
SawTooth_Out: Amplifier_Section (J10.2), Saw Tooth and PWM Generator (R12.2 U8.1)
Sine_Out: Amplifier_Section (J10.4), Sine_Wave_Generator (C19.2 R11.2)
Square_In: Saw Tooth and PWM Generator (Q8.1), Triangle_Generator (R3.1 R4.2 U4.1)
Triangle_In_PWM: Saw Tooth and PWM Generator (U8.5), Buffers (U6.1 U6.2)
Triangle_In_Sawtooth: Saw Tooth and PWM Generator (R15.1 R16.1), Buffers (R6.2 U5.7)
Triangle_In_Sine: Sine_Wave_Generator (R9.1), Buffers (U6.6 U6.7)
Triangle_Out: Amplifier_Section (J10.1), Buffers (U5.3), Triangle_Generator (J2.1 R5.1 U4.7)